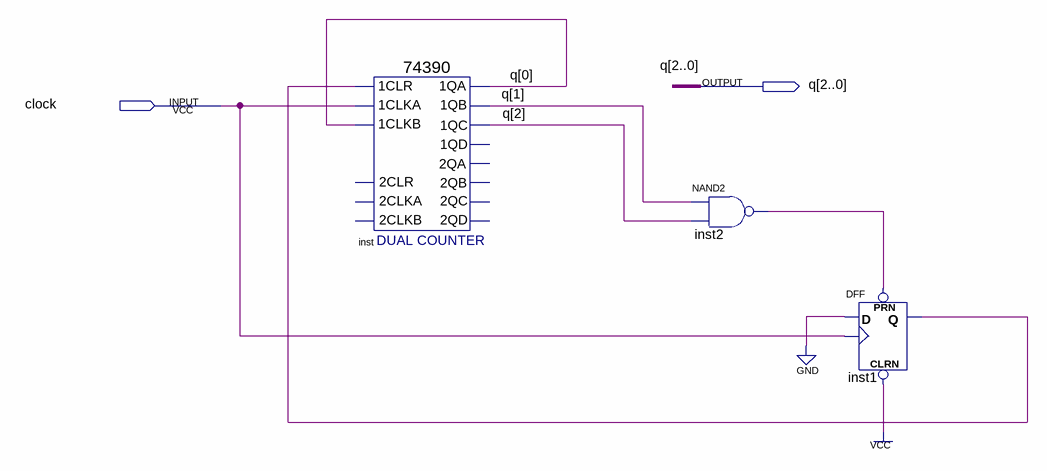
[diagram p0: schematic sheet]
// Quartus schematic cnt6.bdf as structural Verilog: 3 symbols, 2 pins
module cnt6 (
  input  clock,
  output [2:0] q
);

  wire inst1_q, inst2_out;

  \74390  inst (
    .\1CLR (inst1_q), .\1CLKA (clock), .\1CLKB (q[0]), .\1QA (q[0]), .\1QB (q[1]), .\1QC (q[2]));  // open: 2CLKA, 2CLR, 2CLKB, 1QD, 2QA, 2QB, 2QC, 2QD
  nand inst2 (inst2_out, q[1], q[2]);
  DFF inst1 (.CLRN(1'b1), .CLK(clock), .D(1'b0), .PRN(inst2_out), .Q(inst1_q));
endmodule
